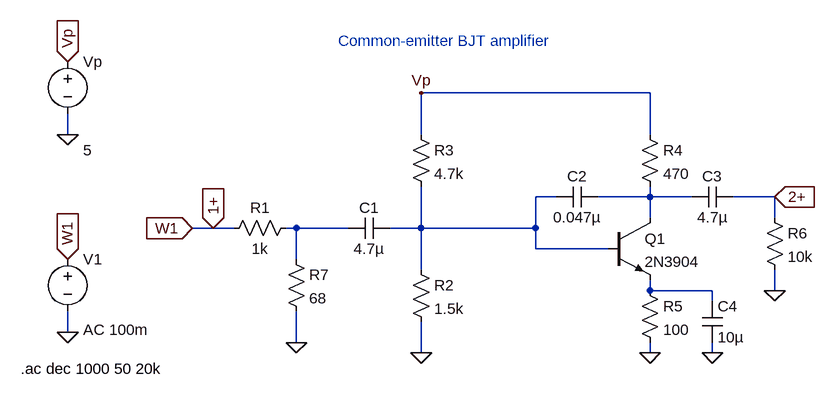
[diagram p0: schematic freq_resp_bjt.asc]
freq_resp_bjt.asc, the LTspice schematic file:
Version 4
SHEET 1 1008 680
WIRE 720 -144 368 -144
WIRE -176 -80 -176 -112
WIRE 368 -80 368 -144
WIRE 720 -80 720 -144
WIRE 576 16 544 16
WIRE 720 16 720 0
WIRE 720 16 640 16
WIRE 784 16 720 16
WIRE 912 16 848 16
WIRE 720 48 720 16
WIRE 912 48 912 16
WIRE 48 64 16 64
WIRE 80 64 48 64
WIRE 176 64 160 64
WIRE 256 64 176 64
WIRE 368 64 368 0
WIRE 368 64 320 64
WIRE 544 64 544 16
WIRE 544 64 368 64
WIRE 544 96 544 64
WIRE 656 96 544 96
WIRE 176 112 176 64
WIRE 368 128 368 64
WIRE 720 160 720 144
WIRE 816 160 720 160
WIRE 912 160 912 128
WIRE 816 176 816 160
WIRE -176 224 -176 192
WIRE 176 240 176 192
WIRE 368 256 368 208
WIRE 720 256 720 240
WIRE 816 256 816 240
FLAG -176 224 0
FLAG 368 256 0
FLAG 720 256 0
FLAG 912 160 0
FLAG 816 256 0
FLAG 176 240 0
FLAG 368 -144 Vp
FLAG -176 112 W1
IOPIN -176 112 In
FLAG 16 64 W1
IOPIN 16 64 In
FLAG -176 -80 0
FLAG -176 -192 Vp
IOPIN -176 -192 In
FLAG 912 16 2+
IOPIN 912 16 In
FLAG 48 64 1+
IOPIN 48 64 In
SYMBOL voltage -176 96 R0
WINDOW 123 24 124 Left 2
WINDOW 39 0 0 Left 0
SYMATTR Value2 AC 100m
SYMATTR InstName V1
SYMATTR Value ""
SYMBOL res 176 48 R90
WINDOW 0 0 56 VBottom 2
WINDOW 3 32 56 VTop 2
SYMATTR InstName R1
SYMATTR Value 1k
SYMBOL cap 320 48 R90
WINDOW 0 0 32 VBottom 2
WINDOW 3 32 32 VTop 2
SYMATTR InstName C1
SYMATTR Value 4.7µ
SYMBOL res 352 112 R0
SYMATTR InstName R2
SYMATTR Value 1.5k
SYMBOL res 352 -96 R0
SYMATTR InstName R3
SYMATTR Value 4.7k
SYMBOL res 704 -96 R0
SYMATTR InstName R4
SYMATTR Value 470
SYMBOL cap 640 0 R90
WINDOW 0 0 32 VBottom 2
WINDOW 3 32 32 VTop 2
SYMATTR InstName C2
SYMATTR Value 0.047µ
SYMBOL npn 656 48 R0
SYMATTR InstName Q1
SYMATTR Value 2N3904
SYMBOL res 704 144 R0
SYMATTR InstName R5
SYMATTR Value 100
SYMBOL cap 848 0 R90
WINDOW 0 0 32 VBottom 2
WINDOW 3 32 32 VTop 2
SYMATTR InstName C3
SYMATTR Value 4.7µ
SYMBOL res 896 32 R0
SYMATTR InstName R6
SYMATTR Value 10k
SYMBOL cap 800 176 R0
SYMATTR InstName C4
SYMATTR Value 10µ
SYMBOL res 160 96 R0
SYMATTR InstName R7
SYMATTR Value 68
SYMBOL voltage -176 -208 R0
WINDOW 123 24 124 Left 2
WINDOW 39 0 0 Left 0
WINDOW 3 24 152 Left 2
SYMATTR InstName Vp
SYMATTR Value 5
TEXT -248 280 Left 2 !.ac dec 1000 50 20k
TEXT 240 -224 Left 2 ;Common-emitter BJT amplifier

The netlist it stands for:
* freq_resp_bjt.asc
V1 1+ 0 AC 100m
R1 N003 1+ 1k
C1 N001 N003 4.7µ
R2 N001 0 1.5k
R3 Vp N001 4.7k
R4 Vp N002 470
C2 N002 N001 0.047µ
Q1 N002 N001 N004 0 2N3904
R5 N004 0 100
C3 2+ N002 4.7µ
R6 2+ 0 10k
C4 N004 0 10µ
R7 N003 0 68
Vp Vp 0 5
.model NPN NPN
.model PNP PNP
.lib standard.bjt
.ac dec 1000 50 20k
* Common-emitter BJT amplifier
.backanno
.end